# EAGLE design scheda (EAGLE 4.14)
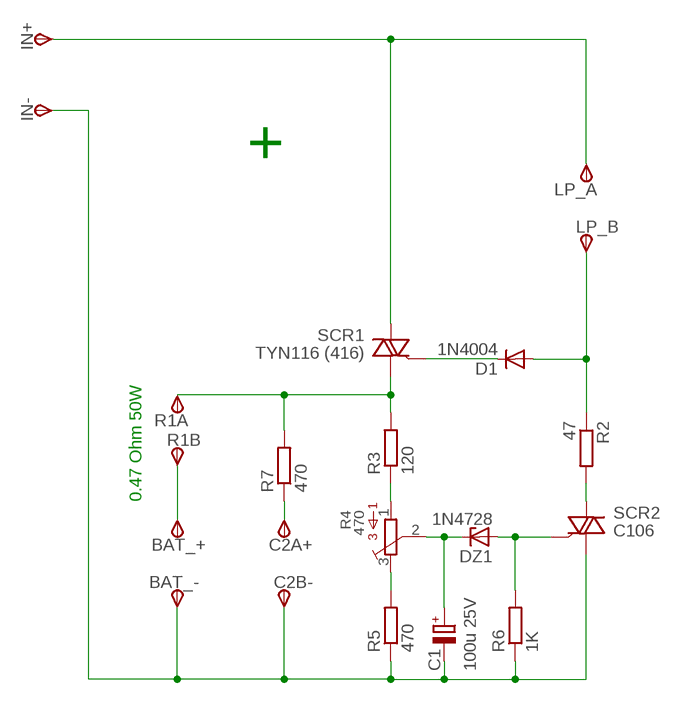
[diagram p0: schematic, sheet 1]

## Parts
BAT_+  TPSPAD1-20Y  [P1-20Y]
BAT_-  TPSPAD1-20Y  [P1-20Y]
C1  100u 25V  CPOL-EUE2,5-6E  [E2,5-6E]
C2A+  TPSPAD1-20Y  [P1-20Y]
C2B-  TPSPAD1-20Y  [P1-20Y]
D1  1N4004  [DO41-10]
DZ1  1N4728  [DO41Z10]
IN+  TPSPAD1-20Y  [P1-20Y]
IN-  TPSPAD1-20Y  [P1-20Y]
LP_A  TPSPAD1-20Y  [P1-20Y]
LP_B  TPSPAD1-20Y  [P1-20Y]
R1A  TPSPAD1-20Y  [P1-20Y]
R1B  TPSPAD1-20Y  [P1-20Y]
R2  47  R-EU_0207/15  [0207/15]
R3  120  R-EU_0207/15  [0207/15]
R4  470  3362H  [3362H]
R5  470  R-EU_0207/15  [0207/15]
R6  1K  R-EU_0207/15  [0207/15]
R7  470  R-EU_0207/15  [0207/15]
SCR1  TYN116 (416)  TIC253  [TO218DS]
SCR2  C106  TIC225S  [TO220DS]

## Nets
N$1: IN+.1(PP) LP_A.1(PP) SCR1.A2
N$2: C2A+.1(PP) R7.1
N$3: D1.C SCR1.G
N$4: D1.A LP_B.1(PP) R2.1
N$5: R2.2 SCR2.A2
N$6: DZ1.A R6.2 SCR2.G
N$7: C1.+ DZ1.C R4.2
N$8: R1A.1(PP) R3.2 R7.2 SCR1.A1
N$9: R3.1 R4.1
N$10: R4.3 R5.2
N$11: BAT_-.1(PP) C1.- C2B-.1(PP) IN-.1(PP) R5.1 R6.1 SCR2.A1
N$13: BAT_+.1(PP) R1B.1(PP)

## Notes on the sheet
- +
- 0.47 Ohm 50W

## Library data of the parts
BAT_+ BAT_- C2A+ C2B- IN+ IN- LP_A LP_B R1A R1B = testpad:TPS: TEST PIN
C1 = rcl:CPOL-EU: POLARIZED CAPACITOR, European symbol
D1 = diode:1N4004: DIODE general purpose rectifier, 1 A
DZ1 = diode:1N4728: Z DIODE 3.3 V, 1W, 5 percent
R2 R3 R5-R7 = rcl:R-EU_: RESISTOR, European symbol
R4 = BOURNS:3362: 3362 Series 1/4" Square Trimmer
SCR1 = triac:TIC253: TRIAC
SCR2 = triac:TIC225S: TRIAC

## Board
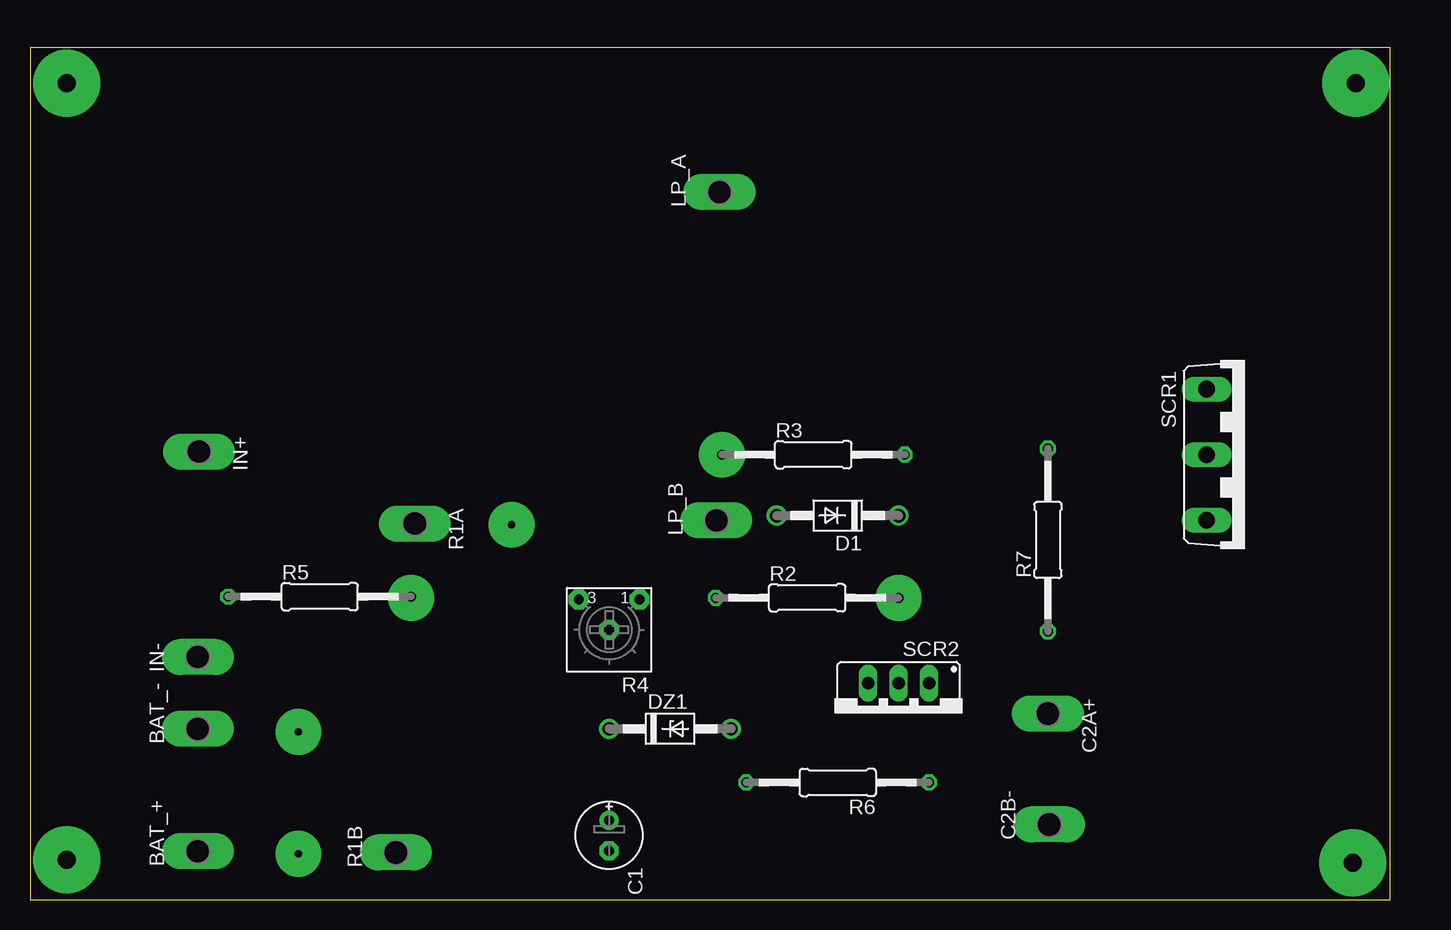
[diagram p1: board, top side]
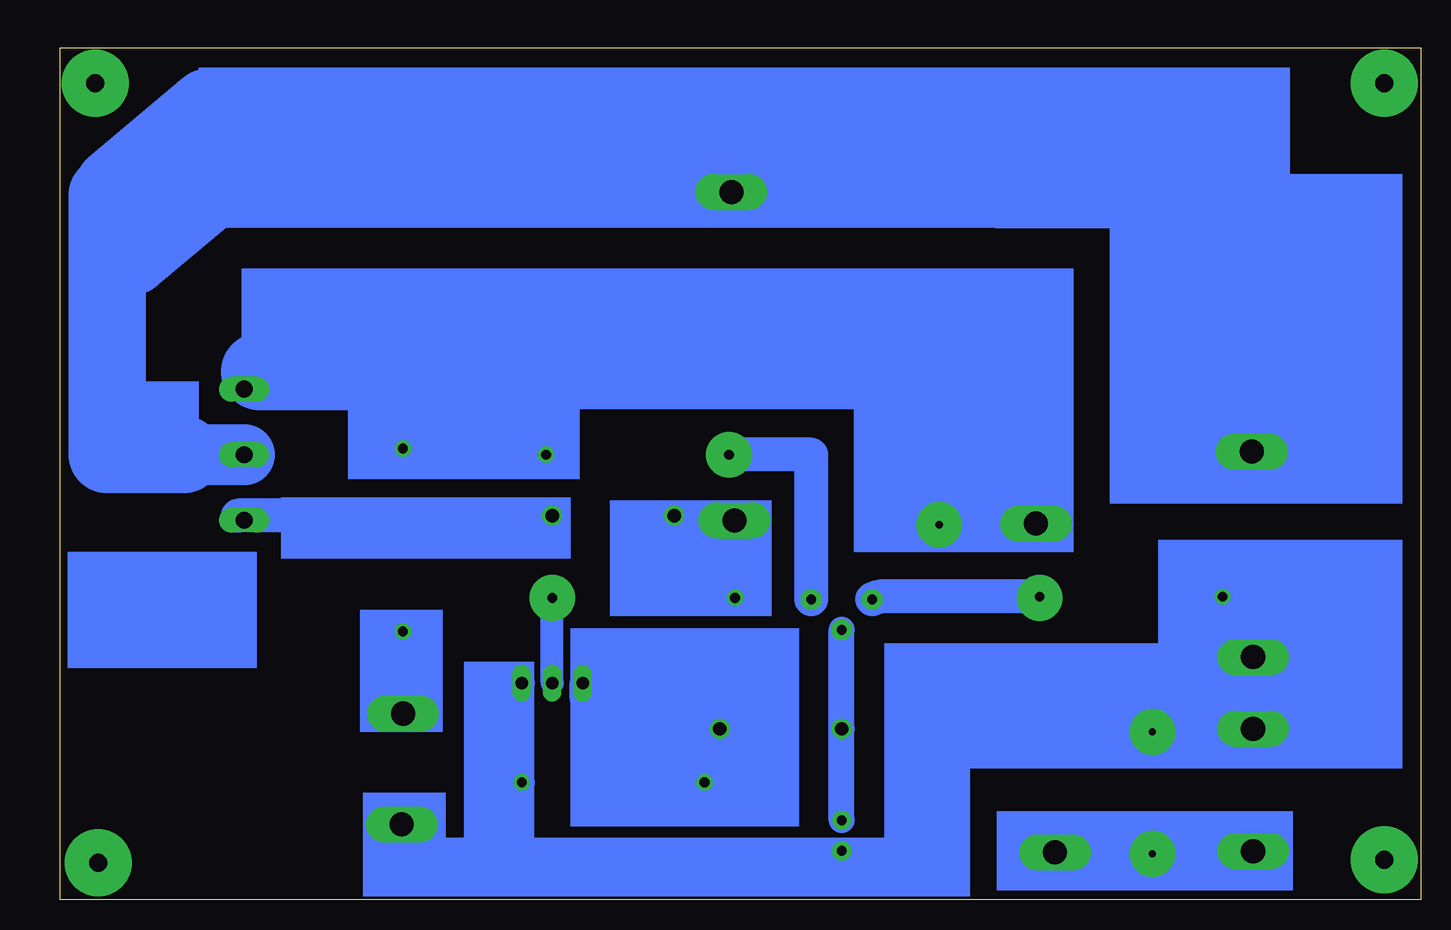
[diagram p2: board, bottom side, seen from below]

Size 113.42 x 71.04 mm. Coordinates in mm from the lower left corner, seen from the top.
Outline: 0,0 113.42,0 113.42,71.04 0,71.04 0,0
Copper layers (1*16): Top 0.035mm / dielectric 1.5mm / Bottom 0.035mm
Design rules "default": minimum track width 70mil, minimum drill 24mil, track to track 8mil, track to pad 8mil, pad to pad 8mil, via to via 8mil, smd to smd 8mil, copper to edge 40mil, drill to drill 8mil, minimum pad ring 10mil, minimum via ring 8mil, stop-mask expansion 4mil, vias tented up to drill 0mil, thermal gap 10mil

### Footprints (pad centres in the part's own frame; a part is rotated, then mirrored left to right if it is on the bottom)
P1-20Y = drill 2.007 pad 2.54 long: 1 0,0
E2,5-6E = drill 0.813 pad 1.575 round: + -1.27,0 | drill 0.813 pad 1.575 octagon: - 1.27,0
DO41-10 = drill 1.118 round: A 5.08,0; C -5.08,0
DO41Z10 = drill 1.118 round: A 5.08,0; C -5.08,0
0207/15 = drill 0.813 octagon: 1 -7.62,0; 2 7.62,0
3362H = drill 0.813 pad 1.676 octagon: 1 -2.54,-3.175; 2 0,-0.635; 3 2.54,-3.175
TO218DS = drill 1.397 long: A1 -5.461,-3.175; A2 0,-3.175; G 5.461,-3.175
TO220DS = drill 1.016 long: A1 -2.54,-2.54; A2 0,-2.54; G 2.54,-2.54

### Placement (x,y rotation side)
BAT_+  13.99,4.03 90 top
BAT_-  13.99,14.24 90 top
C1  48.28,5.35 270 top
C2A+  84.86,15.51 270 top
C2B-  84.96,6.26 90 top
D1  67.33,32.02 180 top
DZ1  53.36,14.24 0 top
IN+  14.09,37.35 270 top
IN-  13.99,20.23 90 top
LP_A  57.48,58.99 90 top
LP_B  57.22,31.61 90 top
R1A  32.08,31.36 270 top
R1B  30.5,3.92 90 top
R2  64.79,25.16 0 top
R3  65.3,37.1 0 top
R4  48.28,21.86 180 top
R5  24.15,25.26 0 top
R6  67.33,9.77 180 top
R7  84.86,29.98 90 top
SCR1  101.26,37.1 270 top
SCR2  72.41,15.51 180 top

### Tracks (layer width: path | path; a pad name or v marks a point on that pad's centre or on a via)
N$1
  Bottom 1.778: LP_A.1 58.44,59.96 56.61,59.21
  Bottom 5.08: 103.14,37.1 SCR1.A2
  Bottom 6.452: IN+.1 14.35,37.35 14.35,59.14 56.61,59.21 99.08,59.25 109.49,58.74 109.49,37.1 103.14,37.1
N$2
  Bottom 2.184: R7.1 C2A+.1 84.6,15.51
N$3
  Bottom 1.778: 98.62,32.02 SCR1.G
  Bottom 2.845: D1.C 98.62,32.02
N$4
  Bottom 1.778: 57.17,32.02 LP_B.1
  Bottom 2.54: R2.1 57.17,32.02 D1.A
N$5
  Bottom 1.93: SCR2.A2 R2.2
N$6
  Bottom 2.184: 69.26,13.98 69.87,16.78 SCR2.G
  Bottom 2.845: R6.2 59.96,13.98 | 59.96,13.98 DZ1.A | 59.96,13.98 69.26,13.98
N$7
  Bottom 2.184: C1.+ DZ1.C R4.2
N$8
  Bottom 1.778: 96.79,44.01 SCR1.A1
  Bottom 2.184: 84.86,44.01 R7.2
  Bottom 2.54: 32.08,31.25 32.02,31.25 | R1A.1 32.08,31.25 | 32.23,32.52 32.23,31.25 32.08,31.25
  Bottom 3.81: 72.41,43.45 R3.2
  Bottom 5.08: 72.41,44.11 72.41,43.45
  Bottom 6.452: 32.23,32.52 32.23,44.11 72.41,44.11 | 96.79,44.01 84.86,44.01 74.29,44.01 72.41,43.45
N$9
  Bottom 2.845: R3.1 50.82,37.1 R4.1
N$10
  Bottom 2.845: R5.2 45.13,25.26 R4.3
N$11
  Bottom 2.184: SCR2.A1 R6.1 74.95,4.08 | 39.39,4.08 C1.- 74.95,4.08 | 84.86,6.62 84.86,6.26 | 84.86,6.26 C2B-.1 | 74.95,4.08 84.86,4.08 84.86,6.26
  Bottom 2.845: BAT_-.1 39.39,14.24 39.39,4.08
  Bottom 6.452: BAT_-.1 IN-.1 R5.1
N$12  (via drill 1.5 pad 5.59)
  other vias: 3.07,68.08 110.51,68.08
N$13
  Bottom 2.54: BAT_+.1 13.99,4.08 31.01,4.08 31.01,3.82 30.5,3.82 | 30.5,3.82 30.25,3.82 | 30.5,3.82 R1B.1
N$14  (via drill 1.5 pad 5.59)
  other vias: 3.07,3.31
N$15  (via drill 1.5 pad 5.59)
  other vias: 110.26,3.06
N$16  (via drill 0.6 pad 3.81)
  other vias: 22.37,13.98
N$17  (via drill 0.6 pad 3.81)
  other vias: 72.41,25.16
N$18  (via drill 0.6 pad 3.81)
  other vias: 57.68,37.1
N$19  (via drill 0.6 pad 3.81)
  other vias: 31.77,25.16
N$20
  Bottom 6.452: 107.46,53.61 99.59,60.21 | 108.99,59.45 101.11,66.05
N$21  (via drill 0.6 pad 3.81)
  other vias: 40.15,31.25
N$22  (via drill 0.6 pad 3.81)
  other vias: 22.37,3.82
(copper drawn outside any net)
  shapes: Bottom area x19